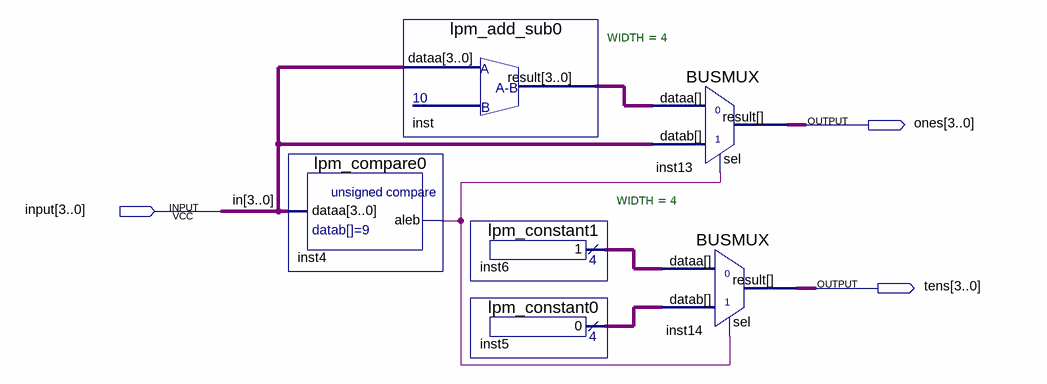
[diagram p0: schematic sheet]
// Quartus schematic Recoder.bdf as structural Verilog: 6 symbols, 3 pins
module Recoder (
  input  [3:0] \input ,
  output [3:0] ones,
  output [3:0] tens
);

  wire inst4_aleb;
  wire [3:0] inst5_result, inst6_result, inst_result;

  lpm_compare0 inst4 (.dataa(\input ), .aleb(inst4_aleb));
  lpm_add_sub0 inst (.dataa(\input ), .result(inst_result));
  lpm_constant1 inst6 (.result(inst6_result));
  lpm_constant0 inst5 (.result(inst5_result));
  BUSMUX #(.WIDTH(4)) inst13 (.datab(\input ), .sel(inst4_aleb), .dataa(inst_result), .result(ones));
  BUSMUX #(.WIDTH(4)) inst14 (.datab(inst5_result), .sel(inst4_aleb), .dataa(inst6_result), .result(tens));

  // Other names for the same wires on the sheet: in[3:0] = \input 
endmodule
